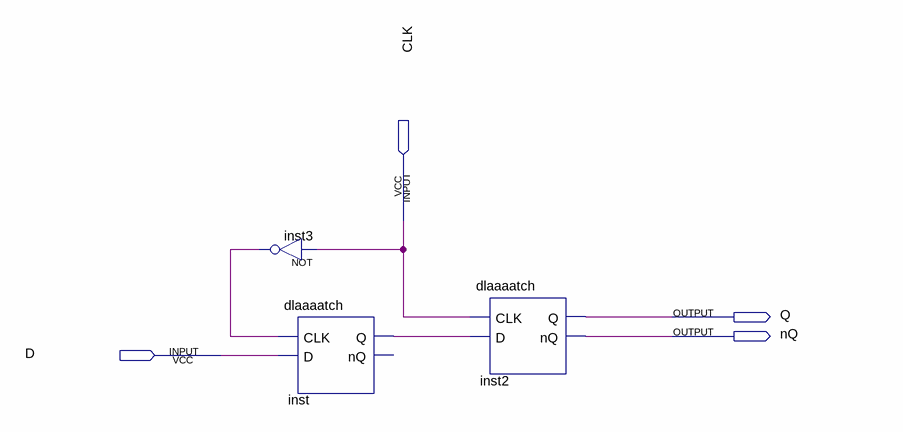
[diagram p0: schematic sheet]
// Quartus schematic dflipflop.bdf as structural Verilog: 3 symbols, 4 pins
module dflipflop (
  input  CLK,
  input  D,
  output Q,
  output nQ
);

  wire inst3_out, inst_q;

  not inst3 (inst3_out, CLK);
  dlaaaatch inst (.CLK(inst3_out), .D(D), .Q(inst_q));  // open: nQ
  dlaaaatch inst2 (.CLK(CLK), .D(inst_q), .Q(Q), .nQ(nQ));
endmodule
